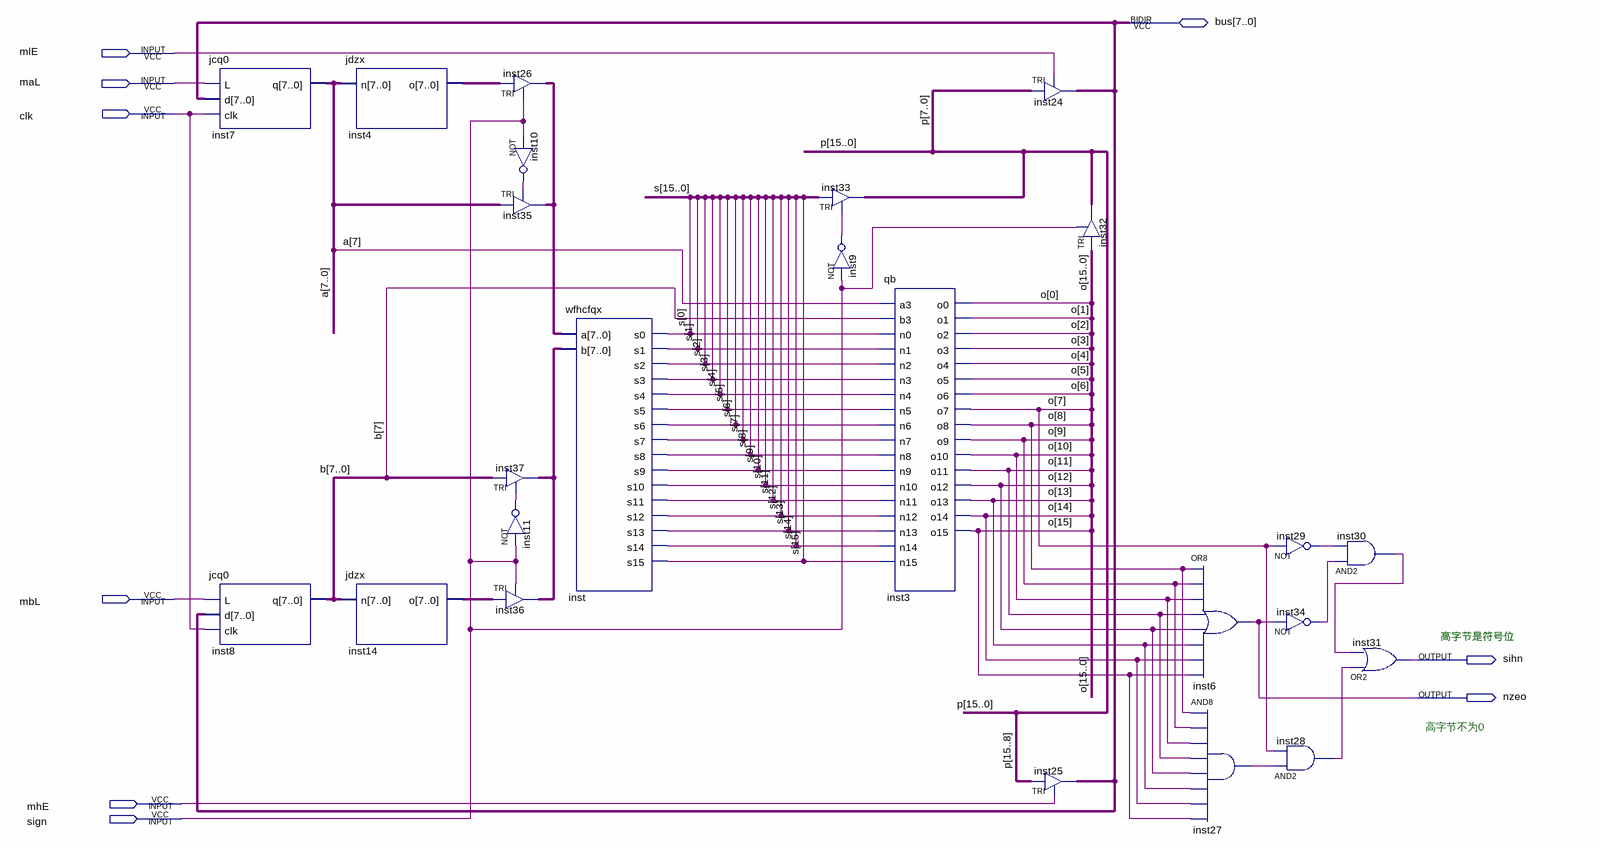
[diagram p0: schematic sheet]
// Quartus schematic multq.bdf as structural Verilog: 24 symbols, 9 pins
module multq (
  input  mlE,
  input  maL,
  input  clk,
  input  mbL,
  input  mhE,
  input  sign,
  inout  [7:0] bus,
  output sihn,
  output nzeo
);

  wire inst9_out, inst10_out, inst11_out, inst27_out, inst28_out, inst29_out, inst30_out, inst34_out;
  wire [7:0] a, b, inst4_o, inst14_o, inst26_out, inst37_out;
  wire [15:0] o, p, s;

  jcq0 inst7 (.L(maL), .d(bus), .clk(clk), .q(a));
  jcq0 inst8 (.L(mbL), .d(bus), .clk(clk), .q(b));
  jdzx inst4 (.n(a), .o(inst4_o));
  jdzx inst14 (.n(b), .o(inst14_o));
  TRI inst26[7:0] (.IN(inst4_o), .OE(sign), .OUT(inst26_out));
  not inst10 (inst10_out, sign);
  TRI inst35[7:0] (.IN(a), .OE(inst10_out), .OUT(inst26_out));
  TRI inst37[7:0] (.IN(b), .OE(inst11_out), .OUT(inst37_out));
  not inst11 (inst11_out, sign);
  TRI inst36[7:0] (.IN(inst14_o), .OE(sign), .OUT(inst37_out));
  wfhcfqx inst (
    .a(inst26_out), .b(inst37_out), .s0(s[0]), .s1(s[1]), .s2(s[2]), .s3(s[3]), .s4(s[4]), .s5(s[5]),
    .s6(s[6]), .s7(s[7]), .s8(s[8]), .s9(s[9]), .s10(s[10]), .s11(s[11]), .s12(s[12]), .s13(s[13]),
    .s14(s[14]), .s15(s[15]));
  TRI inst33[15:0] (.IN(s), .OE(inst9_out), .OUT(p));
  not inst9 (inst9_out, sign);
  qb inst3 (
    .a3(a[7]), .b3(b[7]), .n0(s[0]), .n1(s[1]), .n2(s[2]), .n3(s[3]), .n4(s[4]), .n5(s[5]), .n6(s[6]),
    .n7(s[7]), .n8(s[8]), .n9(s[9]), .n10(s[10]), .n11(s[11]), .n12(s[12]), .n13(s[13]), .n14(s[14]),
    .n15(s[15]), .o0(o[0]), .o1(o[1]), .o2(o[2]), .o3(o[3]), .o4(o[4]), .o5(o[5]), .o6(o[6]), .o7(o[7]),
    .o8(o[8]), .o9(o[9]), .o10(o[10]), .o11(o[11]), .o12(o[12]), .o13(o[13]), .o14(o[14]), .o15(o[15]));
  TRI inst24[7:0] (.IN(p[7:0]), .OE(mlE), .OUT(bus));
  TRI inst25[7:0] (.IN(p[15:8]), .OE(mhE), .OUT(bus));
  TRI inst32[15:0] (.IN(o), .OE(sign), .OUT(p));
  or inst6 (nzeo, o[8], o[9], o[10], o[11], o[12], o[13], o[14], o[15]);
  and inst27 (inst27_out, o[8], o[9], o[10], o[11], o[12], o[13], o[14], o[15]);
  not inst29 (inst29_out, o[7]);
  not inst34 (inst34_out, nzeo);
  and inst28 (inst28_out, inst27_out, o[7]);
  and inst30 (inst30_out, inst34_out, inst29_out);
  or inst31 (sihn, inst28_out, inst30_out);

  // Notes on the sheet:
  //   高字节是符号位
  //   高字节不为0
endmodule
